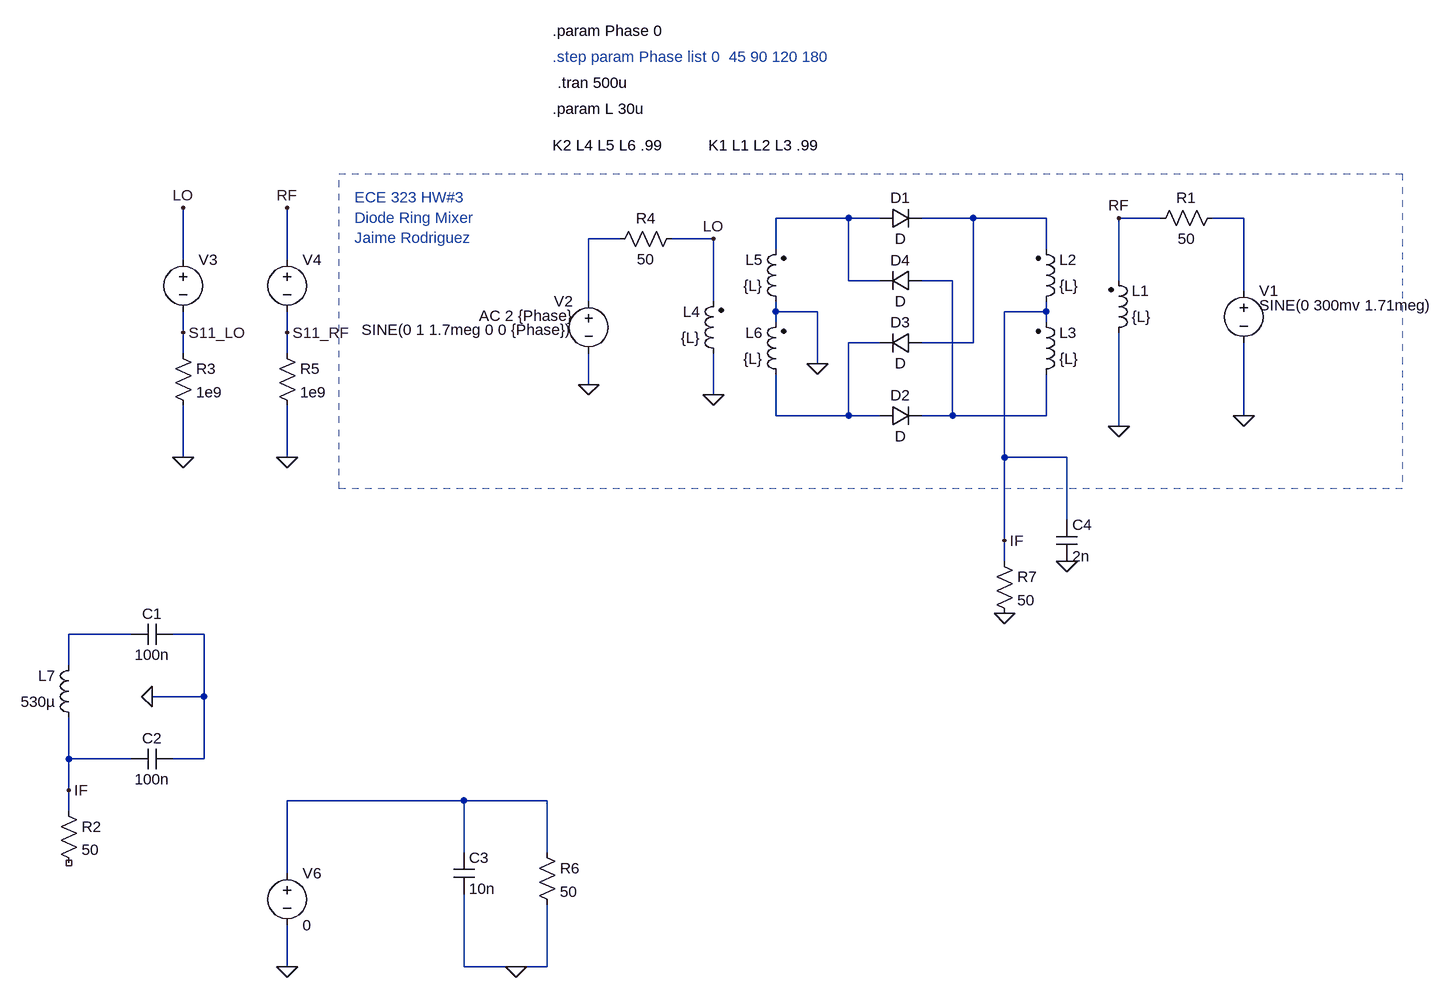
[diagram p0: schematic Diode ring.asc]
Diode ring.asc, the LTspice schematic file:
Version 4
SHEET 1 880 1216
WIRE -304 48 -416 48
WIRE -256 48 -304 48
WIRE -112 48 -192 48
WIRE 0 48 -112 48
WIRE 176 48 112 48
WIRE 304 48 256 48
WIRE -656 80 -704 80
WIRE -512 80 -576 80
WIRE -416 96 -416 48
WIRE 0 96 0 48
WIRE -1328 112 -1328 32
WIRE -1168 112 -1168 32
WIRE -304 144 -304 48
WIRE -256 144 -304 144
WIRE -144 144 -192 144
WIRE 112 144 112 48
WIRE 304 160 304 48
WIRE -704 176 -704 80
WIRE -512 176 -512 80
WIRE -416 192 -416 176
WIRE -352 192 -416 192
WIRE 0 192 0 176
WIRE 0 192 -64 192
WIRE -416 208 -416 192
WIRE 0 208 0 192
WIRE -1328 224 -1328 192
WIRE -1168 224 -1168 192
WIRE -256 240 -304 240
WIRE -112 240 -112 48
WIRE -112 240 -192 240
WIRE -1328 256 -1328 224
WIRE -1168 256 -1168 224
WIRE -352 272 -352 192
WIRE -704 304 -704 256
WIRE -512 320 -512 256
WIRE -416 352 -416 288
WIRE -304 352 -304 240
WIRE -304 352 -416 352
WIRE -256 352 -304 352
WIRE -144 352 -144 144
WIRE -144 352 -192 352
WIRE 0 352 0 288
WIRE 0 352 -144 352
WIRE 304 352 304 240
WIRE 112 368 112 224
WIRE -1328 416 -1328 336
WIRE -1168 416 -1168 336
WIRE -64 416 -64 192
WIRE 32 416 -64 416
WIRE 32 512 32 416
WIRE -64 544 -64 416
WIRE -64 576 -64 544
WIRE -1408 688 -1504 688
WIRE -1296 688 -1344 688
WIRE -1504 736 -1504 688
WIRE -1296 784 -1296 688
WIRE -1296 784 -1376 784
WIRE -1504 880 -1504 816
WIRE -1408 880 -1504 880
WIRE -1296 880 -1296 784
WIRE -1296 880 -1344 880
WIRE -1504 928 -1504 880
WIRE -896 944 -1168 944
WIRE -768 944 -896 944
WIRE -1504 960 -1504 928
WIRE -896 1024 -896 944
WIRE -768 1024 -768 944
WIRE -1168 1056 -1168 944
WIRE -1168 1200 -1168 1136
WIRE -896 1200 -896 1088
WIRE -816 1200 -896 1200
WIRE -768 1200 -768 1104
WIRE -768 1200 -816 1200
FLAG 304 352 0
FLAG 112 368 0
FLAG -704 304 0
FLAG -512 320 0
FLAG -1376 784 0
FLAG -512 80 LO
FLAG 112 48 RF
FLAG -1504 928 IF
FLAG -1328 416 0
FLAG -1168 416 0
FLAG -1328 32 LO
FLAG -1168 32 RF
FLAG -1328 224 S11_LO
FLAG -1168 224 S11_RF
FLAG -1168 1200 0
FLAG -816 1200 0
FLAG -352 272 0
FLAG 32 576 0
FLAG -64 544 IF
FLAG -64 656 0
SYMBOL ind2 -16 192 M180
WINDOW 0 36 80 Left 2
WINDOW 3 36 40 Left 2
SYMATTR InstName L2
SYMATTR Value {L}
SYMATTR Type ind
SYMBOL ind2 -16 304 M180
WINDOW 0 36 80 Left 2
WINDOW 3 36 40 Left 2
SYMATTR InstName L3
SYMATTR Value {L}
SYMATTR Type ind
SYMBOL voltage 304 144 R0
WINDOW 3 24 38 Left 2
SYMATTR Value SINE(0 300mv 1.71meg)
SYMATTR InstName V1
SYMATTR Value2 AC 1 {P}
SYMBOL ind2 -400 192 R180
WINDOW 0 36 80 Left 2
WINDOW 3 36 40 Left 2
SYMATTR InstName L5
SYMATTR Value {L}
SYMATTR Type ind
SYMBOL ind2 -400 304 R180
WINDOW 0 36 80 Left 2
WINDOW 3 36 40 Left 2
SYMATTR InstName L6
SYMATTR Value {L}
SYMATTR Type ind
SYMBOL voltage -704 160 M0
WINDOW 123 24 38 Left 2
WINDOW 3 24 60 Left 2
SYMATTR Value2 AC 2 {Phase}
SYMATTR Value SINE(0 1 1.7meg 0 0 {Phase})
SYMATTR InstName V2
SYMBOL ind2 -496 272 R180
WINDOW 0 36 80 Left 2
WINDOW 3 36 40 Left 2
SYMATTR InstName L4
SYMATTR Value {L}
SYMATTR Type ind
SYMBOL ind2 96 240 M180
WINDOW 0 36 80 Left 2
WINDOW 3 36 40 Left 2
SYMATTR InstName L1
SYMATTR Value {L}
SYMATTR Type ind
SYMBOL res -560 64 R90
WINDOW 0 0 56 VBottom 2
WINDOW 3 32 56 VTop 2
SYMATTR InstName R4
SYMATTR Value 50
SYMBOL res 272 32 R90
WINDOW 0 0 56 VBottom 2
WINDOW 3 32 56 VTop 2
SYMATTR InstName R1
SYMATTR Value 50
SYMBOL diode -256 64 R270
WINDOW 0 32 32 VTop 2
WINDOW 3 0 32 VBottom 2
SYMATTR InstName D1
SYMBOL diode -256 368 R270
WINDOW 0 32 32 VTop 2
WINDOW 3 0 32 VBottom 2
SYMATTR InstName D2
SYMBOL diode -192 224 R90
WINDOW 0 0 32 VBottom 2
WINDOW 3 32 32 VTop 2
SYMATTR InstName D3
SYMBOL diode -192 128 R90
WINDOW 0 0 32 VBottom 2
WINDOW 3 32 32 VTop 2
SYMATTR InstName D4
SYMBOL cap -1344 672 R90
WINDOW 0 0 32 VBottom 2
WINDOW 3 32 32 VTop 2
SYMATTR InstName C1
SYMATTR Value 100n
SYMBOL cap -1344 864 R90
WINDOW 0 0 32 VBottom 2
WINDOW 3 32 32 VTop 2
SYMATTR InstName C2
SYMATTR Value 100n
SYMBOL ind -1488 832 R180
WINDOW 0 36 80 Left 2
WINDOW 3 36 40 Left 2
SYMATTR InstName L7
SYMATTR Value 530µ
SYMBOL res -1520 944 R0
SYMATTR InstName R2
SYMATTR Value 50
SYMBOL voltage -1328 96 R0
SYMATTR InstName V3
SYMATTR Value ""
SYMATTR Value2 AC .5
SYMBOL voltage -1168 96 R0
SYMATTR InstName V4
SYMATTR Value ""
SYMATTR Value2 AC .5
SYMBOL res -1344 240 R0
SYMATTR InstName R3
SYMATTR Value 1e9
SYMBOL res -1184 240 R0
SYMATTR InstName R5
SYMATTR Value 1e9
SYMBOL voltage -1168 1040 R0
SYMATTR InstName V6
SYMATTR Value 0
SYMATTR Value2 AC 1
SYMBOL cap -912 1024 R0
SYMATTR InstName C3
SYMATTR Value 10n
SYMBOL res -784 1008 R0
SYMATTR InstName R6
SYMATTR Value 50
SYMBOL cap 16 512 R0
SYMATTR InstName C4
SYMATTR Value 2n
SYMBOL res -80 560 R0
SYMATTR InstName R7
SYMATTR Value 50
TEXT -760 -120 Left 2 !.param L 30u
TEXT -752 -160 Left 2 !.tran 500u
TEXT -520 -64 Left 2 !K1 L1 L2 L3 .99
TEXT -760 -64 Left 2 !K2 L4 L5 L6 .99
TEXT -760 -240 Left 2 !.param Phase 0
TEXT -760 -200 Left 2 ;.step param Phase list 0  45 90 120 180
TEXT -1064 16 Left 2 ;ECE 323 HW#3\nDiode Ring Mixer\nJaime Rodriguez
RECTANGLE Normal -1088 -20 548 464 2

The netlist it stands for:
* Diode ring.asc
L2 IF N002 {L}
L3 N005 IF {L}
V1 N003 0 SINE(0 300mv 1.71meg) AC 1 {P}
L5 0 N001 {L}
L6 N006 0 {L}
V2 N004 0 SINE(0 1 1.7meg 0 0 {Phase}) AC 2 {Phase}
L4 0 LO {L}
L1 0 RF {L}
R4 LO N004 50
R1 N003 RF 50
D1 N001 N002 D
D2 N006 N005 D
D3 N002 N006 D
D4 N005 N001 D
C1 0 N007 100n
C2 0 IF 100n
L7 IF N007 530µ
R2 IF NC_01 50
V3 LO S11_LO AC .5
V4 RF S11_RF AC .5
R3 S11_LO 0 1e9
R5 S11_RF 0 1e9
V6 N008 0 0 AC 1
C3 N008 0 10n
R6 N008 0 50
C4 IF 0 2n
R7 IF 0 50
.model D D
.lib standard.dio
.param L 30u
.tran 500u
K1 L1 L2 L3 .99
K2 L4 L5 L6 .99
.param Phase 0
* .step param Phase list 0  45 90 120 180
* ECE 323 HW#3
* Diode Ring Mixer
* Jaime Rodriguez
.backanno
.end